# Altium schematic sheet PowerMeter_Peripherics.SchDoc: Power Meter - Peripherics
size A4; Author: SFARA, Gonzalo Agustín; CompanyName: Introducción al Diseño de Circuitos Impresos; Organization: UTN FRBA; Revision: 02; SheetNumber: 5; SheetTotal: 5
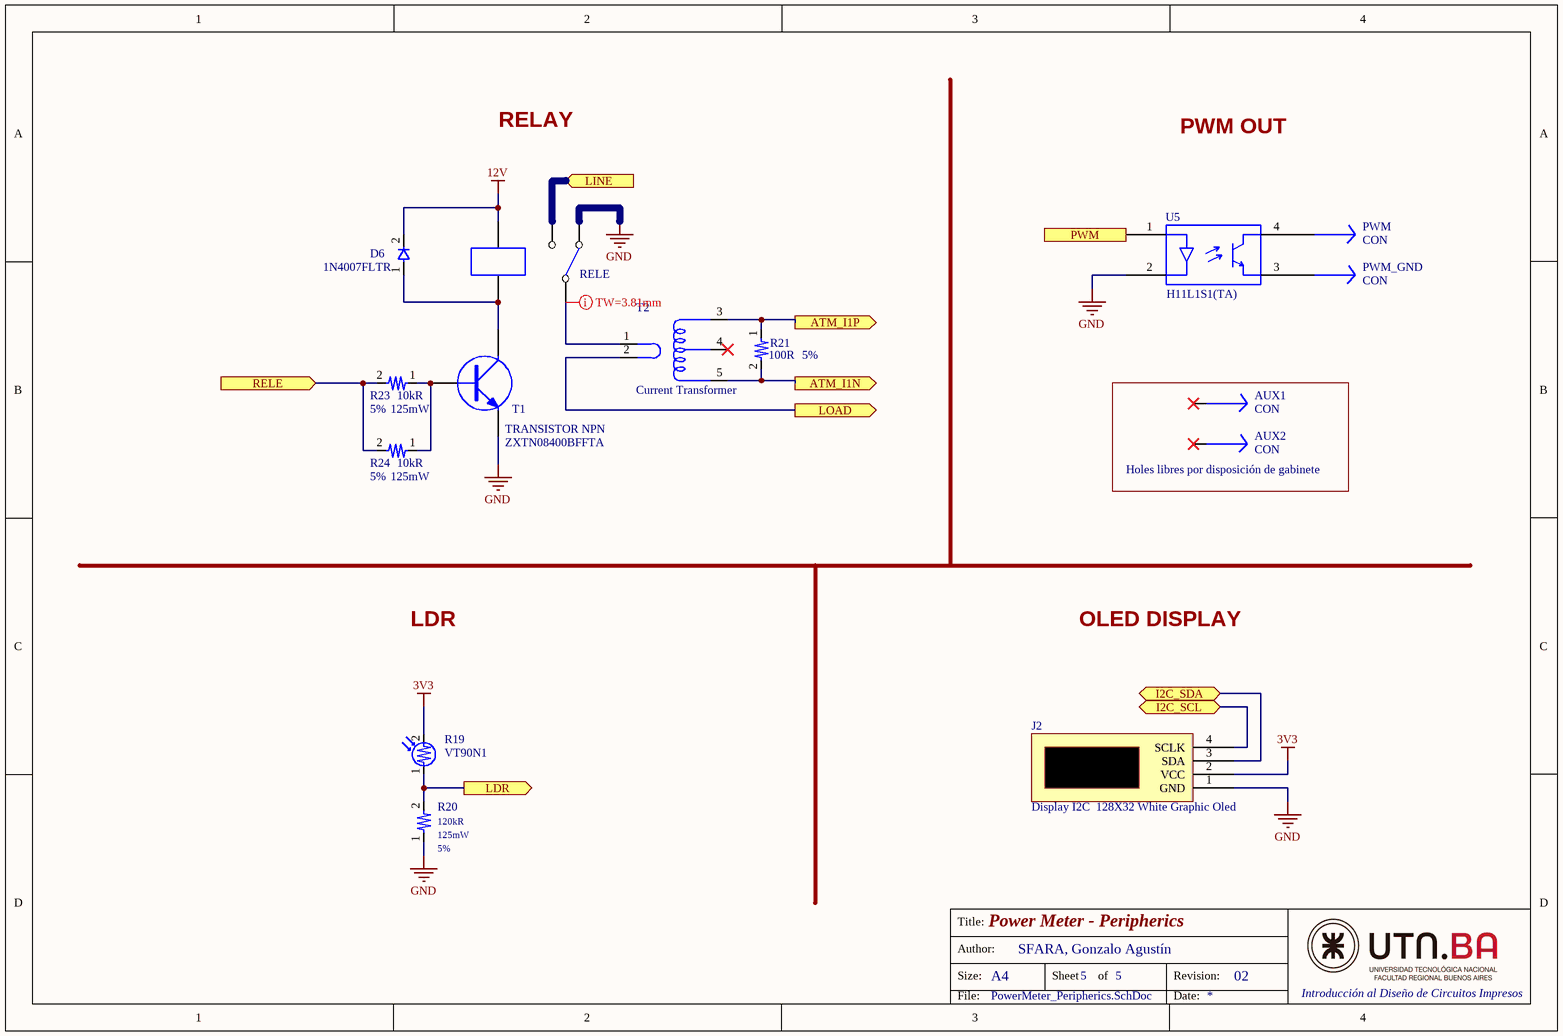
[diagram p0: PowerMeter_Peripherics.SchDoc]

## Parts
AUX1  CON  [HOLE 1.3]  (no BOM)
AUX2  CON  [HOLE 1.3]  (no BOM)
D6  Manufacturer Part Number: 1N4007FLTR  [SOD_123]  (hidden comment: Standard Rectifier 1000V SOD-123)
J2  Display I2C  128X32 White Graphic Oled  [SSD1306]
PWM  CON  [HOLE 1.3]  (no BOM)
PWM_GND  CON  [HOLE 1.3]  (no BOM)
R19  Manufacturer Part Number: VT90N1  [LDR]  (hidden comment: LDR 200 Kohm, 80MW)
R20  Resistance: 120kR  Tolerance: 5%  Max Power Dissipation: 125mW  [R_0805]  (hidden comment: RES 120kOhm 5% 1/8W)
R21  Resistance: 100R  Tolerance: 5%  [R_0805]  (hidden comment: RES 100Ohm 5% 1/8W)
R23  Resistance: 10kR  Tolerance: 5%  Power Rating: 125mW  [R_0805]  (hidden comment: RES 10kOhm 5% 1/8W)
R24  Resistance: 10kR  Tolerance: 5%  Power Rating: 125mW  [R_0805]  (hidden comment: RES 10kOhm 5% 1/8W)
RELE  Relay; 10 A; 12 VDC; PCB; PC Board; SPST-NO; 320 Ohms; 450 mW (Nom.)  T77V1D10-12  [RELE SERIE 964]  (value not drawn)
T1  TRANSISTOR NPN  Manufacturer Part Number: ZXTN08400BFFTA  [SOT23]
T2  Current Transformer  [CT]
U5  Manufacturer Part Number: H11L1S1(TA)  [OPTO GULLWINGx6]  (hidden comment: OPTOACOPLADOR H11L1S1(TA))

## Blocks framed on the sheet
Holes libres por disposición de gabinete: AUX1 AUX2

## Ports
ATM_I1N (out), ATM_I1P (out), I2C_SCL (bidir), I2C_SDA (bidir), LDR (out), LINE (in), LOAD (out), PWM (in), RELE (in)

## Nets
3V3: J2.2(VCC) R19.2
12V: D6.2 RELE.B1
GND: J2.1(GND) R20.1 RELE.NC1 T1.3(E) U5.2
ATM_I1N: R21.2 T2.5(VN) ; port ATM_I1N
ATM_I1P: R21.1 T2.3(VP) ; port ATM_I1P
I2C_SCL: J2.4(SCLK) ; port I2C_SCL
I2C_SDA: J2.3(SDA) ; port I2C_SDA
LDR: R19.1 R20.2 ; port LDR
LINE: RELE.NA1 ; port LINE
LOAD: T2.2(OUT) ; port LOAD
PWM: U5.1 ; port PWM
RELE: R23.2 R24.2 ; port RELE
NetD6_1: D6.1 RELE.B2 T1.2(C)
NetPWM_1: PWM.1 U5.4
NetPWM_GND_1: PWM_GND.1 U5.3
NetR23_1: R23.1 R24.1 T1.1(B)
NetRELE_C1: RELE.C1 T2.1(IN)

Not connected (* = marked no-connect by the designer): AUX1 1*; AUX2 1*; T2 4(MP)*

## Layout directives
rule Width Constraint [Pref Width = 150mil    Min Width = 70mil    Max Width = 180mil]: NetRELE_C1

## Notes on the sheet
- RELAY
- PWM OUT
- LDR
- OLED DISPLAY
- Title:
- Size:
- Author:
- A4
- Sheet
- of
- Revision:
- File:
- Date:

## Library data of the parts
AUX1 AUX2 PWM PWM_GND = CON: Hole
D6 = DIODE: Manufacturer: Sangdest Microelectronics; Supplier 1: Digi-Key; Supplier Part Number 1: 1655-1N4007FLCT-ND; RoHS: No; Stock 1: 1344; Pricing 1: 1=0,15000, 10=0,13400, 100=0,07310, 500=0,04502, 1000=0,03069 (USD)
J2 = Display I2C: Manufacturer: Focus LCDs; Manufacturer Part Number: O12832A-GW-TW3; Supplier 1: Digi-Key; Supplier Part Number 1: 2632-O12832A-GW-TW3-ND; RoHS: No; Description: 128X32 White Graphic Oled
R19 = LDR: 200 Kohm, 80MW; Manufacturer: Excelitas; Voltage Rating: 100V; Resistance: 200000R; Supplier 1: Newark; Supplier Part Number 1: 87X9694; RoHS: Yes; Category: Uncategorized; Pricing 1: 1=4,66000, 10=4,07000, 25=3,76000, 50=3,57000, 100=3,41000, 500=3,29000 (USD); Number of Pins: 2; Weight: 0.01lb; Min Operating Temperature: -40°C; Max Operating Temperature: 75°C; Series: VT900; Power Rating: 80mW; Voltage Rating (DC): 100V; Power Dissipation: 80mW; Length: 0.75inch; Width: 0.25inch; Height: 0.25inch; REACH SVHC: Yes; ComponentLink1URL: https://datasheet.ciiva.com/1249/919043-1249344.pdf?src-supplier=Element14; ComponentLink1Description: https://datasheet.ciiva.com/1249/919043-1249344.pdf?src-supplier=Element14; ComponentLink2URL: https://datasheet.ciiva.com/1252/44-3636dts-vt900seriesdatasheet-1252340.pdf?src-supplier=Farnell; ComponentLink2Description: https://datasheet.ciiva.com/1252/44-3636dts-vt900seriesdatasheet-1252340.pdf?src-supplier=Farnell
R20 = RES: Chip Resistor Automotive Grade Thick Film 0805 120kOhm 5% Paper T/R; Manufacturer: Yageo; Manufacturer Part Number: AC0805JR-07120KL; Voltage Rating: 150V; Temperature Coefficient: 100ppm/°C; Supplier 1: Arrow Electronics; Supplier Part Number 1: AC0805JR-07120KL; RoHS: Yes; Category: Chip SMD Resistors; Stock 1: 15000; Pricing 1: 5000=0,00560, 10000=0,00470 (USD); Case/Package: 0805; Case Code (Imperial): 0805; Case Code (Metric): 2012; Min Operating Temperature: -55°C; Max Operating Temperature: 155°C; Power Rating: 125mW; Packaging: Tape and Reel; Resistor Type: Thick Film; Number of Terminations: 2; Termination: SMD/SMT; Features: Moisture Resistant,Automotive AEC-Q200; Series: AC; Length: 0.079inch; Width: 0.049inch; Height: 0.024inch; RoHS Compliant: Yes; ComponentLink1URL: http://www.mouser.com/ds/2/447/yageodocoutput-1111992.pdf?src-supplier=Mouser; ComponentLink1Description: http://www.mouser.com/ds/2/447/yageodocoutput-1111992.pdf?src-supplier=Mouser; ComponentLink2URL: http://www.yageo.com/NewPortal/yageodocoutput?fileName=/pdf/R-Chip/PYu-AC_51_RoHS_L_6.pdf&src-supplier=Digi-Key; ComponentLink2Description: http://www.yageo.com/NewPortal/yageodocoutput?fileName=/pdf/R-Chip/PYu-AC_51_RoHS_L_6.pdf&src-supplier=Digi-Key
R21 = RES: Anti-Sulfurated Chip Resistor Thick Film 0805 100Ohm 5% Paper T/R; Manufacturer: Yageo; Manufacturer Part Number: AF0805JR-07100RL; Max Power Dissipation: 125mW; Temperature Coefficient: 100ppm/°C; Supplier 1: Digi-Key; Supplier Part Number 1: AF0805JR-07100RL-ND; RoHS: Yes; Category: Chip SMD Resistors; Pricing 1: 5000=0,00940 (USD); Case/Package: 0805; Min Operating Temperature: -55°C; Max Operating Temperature: 155°C; Packaging: Tape and Reel; Resistor Type: Thick Film; Number of Terminations: 2; Features: Moisture Resistant,Anti-Sulfur; Length: 0.079inch; Width: 0.049inch; Height: 0.024inch; ComponentLink1URL: http://www.yageo.com/documents/recent/PYu-AF_51_RoHS_L_5.pdf?src-supplier=Digi-Key; ComponentLink1Description: http://www.yageo.com/documents/recent/PYu-AF_51_RoHS_L_5.pdf?src-supplier=Digi-Key
R23 R24 = RES: Res Thick Film 0805 10K Ohm 5% 1/8W ±200ppm/°C Molded SMD SMD Paper T/R; Manufacturer: Vishay Dale; Manufacturer Part Number: CRCW080510K0JNEB; Voltage Rating: 150V; Supplier 1: Future Electronics; Supplier Part Number 1: 2941144; RoHS: Yes; Category: Chip SMD Resistors; Stock 1: 20000; Pricing 1: 10000=0,02140, 20000=0,01740, 30000=0,01730, 40000=0,01720, 50000=0,01710 (USD); Case/Package: 0805; Weight: 0.000194oz; Case Code (Imperial): 0805; Case Code (Metric): 2012; Contact Plating: Tin; Min Operating Temperature: -55°C; Max Operating Temperature: 155°C; Packaging: Tape and Reel; Package Quantity: 10000; Resistor Type: Thick Film; Termination: SMD/SMT; Number of Terminations: 2; Max Power Dissipation: 125mW; Temperature Coefficient: 200ppm/°C; Voltage Rating (DC): 150V; Working Voltage: 150V; Features: Automotive AEC-Q200; Series: CRCW; Construction: Rectangular; Technology: THICK FILM; Resistance Tolerance: 5%; Length: 2mm; Width: 1.25mm; Height: 0.02inch; Depth: 1.25mm; Radiation Hardening: No; REACH SVHC: Unknown; Military Standard: Not; Lead Free: Lead Free; ComponentLink1URL: https://datasheet.ciiva.com/3258/dcrcwe3-3258030.pdf?src-supplier=Avnet; ComponentLink1Description: https://datasheet.ciiva.com/3258/dcrcwe3-3258030.pdf?src-supplier=Avnet; ComponentLink2URL: https://datasheet.ciiva.com/16199/dcrcwe3-16199191.pdf?src-supplier=Future+Electronics; ComponentLink2Description: https://datasheet.ciiva.com/16199/dcrcwe3-16199191.pdf?src-supplier=Future+Electronics; ComponentLink3URL: https://datasheet.ciiva.com/7725/dcrcwe3-7725772.pdf?src-supplier=Element14; ComponentLink3Description: https://datasheet.ciiva.com/7725/dcrcwe3-7725772.pdf?src-supplier=Element14
RELE = RELE SIMPLE: Relay; 10 A; 12 VDC; PCB; PC Board; SPST-NO; 320 Ohms; 450 mW (Nom.); Manufacturer: TE Connectivity; Throw Configuration: SPST; Coil Resistance: 320R; Coil Current: 37.5mA; Max Voltage Rating (AC): 250V; Max Voltage Rating (DC): 30V; Coil Voltage (DC): 12V; Contact Current Rating: 10A; Operate Time: 10ms; Release Time: 4ms; Coil Power: 500mW; Relay Type: General Purpose; Coil Type: Non-Latching; Power Consumption: 450mW; Approvals: UL,CSA; Supplier 1: Digi-Key; Supplier Part Number 1: T77V1D10-12-ND; Manufacturer Part Number: T77V1D10-12; RoHS: Yes; Category: Signal Relays; Stock 1: 21677; Pricing 1: 1=2,77000, 10=2,59400, 25=2,30600, 50=2,19060, 100=2,07540, 250=1,84476, 500=1,72948, 1000=1,61418, 5000=1,55653 (USD); Mount: Through Hole,PCB; Number of Pins: 4; Contact Material: Silver,Cadmium; Weight: 9g; Min Operating Temperature: -30°C; Max Operating Temperature: 85°C; Package Quantity: 100; Packaging: Bulk; Termination: PCB; Contact Voltage Rating (DC): 30V; Series: T77; Current Rating: 10A; Voltage Rating (AC): 250V; Application(s): GENERAL PURPOSE; Length: 0.717inch; Width: 0.4inch; Height: 14.7mm; Depth: 10.2mm; Radiation Hardening: No; RoHS Compliant: Yes; REACH SVHC: Unknown; ELV: Non-Compliant; Lead Free: Lead Free; ComponentLink1URL: https://datasheet.ciiva.com/7656/1650358-7656336.pdf?src-supplier=Element14; ComponentLink1Description: https://datasheet.ciiva.com/7656/1650358-7656336.pdf?src-supplier=Element14; ComponentLink2URL: https://datasheet.ciiva.com/2406/eng-ds-1308242-t77-1011-2406749.pdf?src-supplier=Digi-Key; ComponentLink2Description: https://datasheet.ciiva.com/2406/eng-ds-1308242-t77-1011-2406749.pdf?src-supplier=Digi-Key; ComponentLink3URL: https://datasheet.ciiva.com/30225/eng-ds-1308242-t77-1011-30225598.pdf?src-supplier=Onlinecomponents.com; ComponentLink3Description: https://datasheet.ciiva.com/30225/eng-ds-1308242-t77-1011-30225598.pdf?src-supplier=Onlinecomponents.com; ComponentLink4URL: https://datasheet.ciiva.com/14531/70198731-14531964.pdf?src-supplier=Allied+Electronics; ComponentLink4Description: https://datasheet.ciiva.com/14531/70198731-14531964.pdf?src-supplier=Allied+Electronics
T1 = TRANSISTOR NPN: ZXTN08400BFF Series NPN 400 V 500 mA 1.5 W Transistor SMT - SOT-23F; Manufacturer: Diodes Zetex; Collector Emitter Voltage (VCEO): 400V; Max Power Dissipation: 2W; Max Collector Current: 500mA; Collector Base Voltage (VCBO): 450V; Frequency: 40MHz; Number of Elements: 1; Emitter Base Voltage (VEBO): 7V; Collector Emitter Saturation Voltage: 175mV; Element Configuration: Single; Supplier 1: RSComponents; Supplier Part Number 1: 7115115; RoHS: Yes; Category: BJTs; Stock 1: 53540; Pricing 1: 10=0,07500, 10=0,05400 (USD); Mount: Surface Mount; Case/Package: SOT-23-3; Number of Pins: 3; Min Operating Temperature: -55°C; Max Operating Temperature: 150°C; Package Quantity: 3000; Packaging: Tape and Reel; Transition Frequency: 40MHz; Collector Emitter Breakdown Voltage: 400V; Max Breakdown Voltage: 400V; Polarity: NPN; Power Dissipation: 2W; Gain Bandwidth Product: 40MHz; Max Frequency: 40MHz; Series: -; Collector-emitter Voltage-Max: 175mV; Length: 3mm; Width: 1.7mm; Height: 1mm; Radiation Hardening: No; REACH SVHC: No SVHC; Lead Free: Lead Free; RoHS Compliant: Yes; ComponentLink1URL: https://datasheet.ciiva.com/975/zxtn08400bff-975107.pdf?src-supplier=Digi-Key; ComponentLink1Description: https://datasheet.ciiva.com/975/zxtn08400bff-975107.pdf?src-supplier=Digi-Key; ComponentLink2URL: https://datasheet.ciiva.com/11207/zxtn08400bff-11207287.pdf?src-supplier=Avnet; ComponentLink2Description: https://datasheet.ciiva.com/11207/zxtn08400bff-11207287.pdf?src-supplier=Avnet; ComponentLink3URL: https://datasheet.ciiva.com/23600/13288-23600135.pdf?src-supplier=Newark; ComponentLink3Description: https://datasheet.ciiva.com/23600/13288-23600135.pdf?src-supplier=Newark; ComponentLink4URL: https://datasheet.ciiva.com/975/zxtn08400bff-975108.pdf?src-supplier=Digi-Key; ComponentLink4Description: https://datasheet.ciiva.com/975/zxtn08400bff-975108.pdf?src-supplier=Digi-Key; ComponentLink5URL: https://datasheet.ciiva.com/975/zxtn08400bff-975109.pdf?src-supplier=Digi-Key; ComponentLink5Description: https://datasheet.ciiva.com/975/zxtn08400bff-975109.pdf?src-supplier=Digi-Key; ComponentLink6URL: https://datasheet.ciiva.com/4723/zxtn08400bff-4723415.pdf?src-supplier=Mouser; ComponentLink6Description: https://datasheet.ciiva.com/4723/zxtn08400bff-4723415.pdf?src-supplier=Mouser; ComponentLink7URL: https://datasheet.ciiva.com/8029/13288-8029818.pdf?src-supplier=Element14; ComponentLink7Description: https://datasheet.ciiva.com/8029/13288-8029818.pdf?src-supplier=Element14; ComponentLink8URL: https://datasheet.ciiva.com/16509/zxtn08400bff-16509014.pdf?src-supplier=Future+Electronics; ComponentLink8Description: https://datasheet.ciiva.com/16509/zxtn08400bff-16509014.pdf?src-supplier=Future+Electronics
T2 = CT
U5 = OPTOACOPLADOR: Optocoupler Logic-Out DC-IN 1-CH 6-Pin SOIC T/R; Manufacturer: Everlight; Direction: Unidirectional; Max Power Dissipation: 250mW; Number of Channels: 1; Forward Voltage: 1.15V; Fall Time: 100ns; Output Current per Channel: 50mA; Propagation Delay: 4us; Input Type: DC; Supplier 1: Digi-Key; Supplier Part Number 1: H11L1S1(TA)-ND; RoHS: Yes; Category: Optocouplers; Pricing 1: 3000=0,28800 (USD); Mount: Surface Mount; Case/Package: SMD/SMT; Number of Pins: 6; Min Operating Temperature: -55°C; Max Operating Temperature: 100°C; Packaging: Tape and Reel; Package Quantity: 1000; Series: -; Radiation Hardening: No; RoHS Compliant: Yes; ComponentLink1URL: https://datasheet.ciiva.com/2085/h11l1s-2085381.pdf?src-supplier=Digi-Key; ComponentLink1Description: https://datasheet.ciiva.com/2085/h11l1s-2085381.pdf?src-supplier=Digi-Key